# Altium schematic sheet LVDS.SchDoc
size A4; SheetNumber: 1; SheetTotal: 1
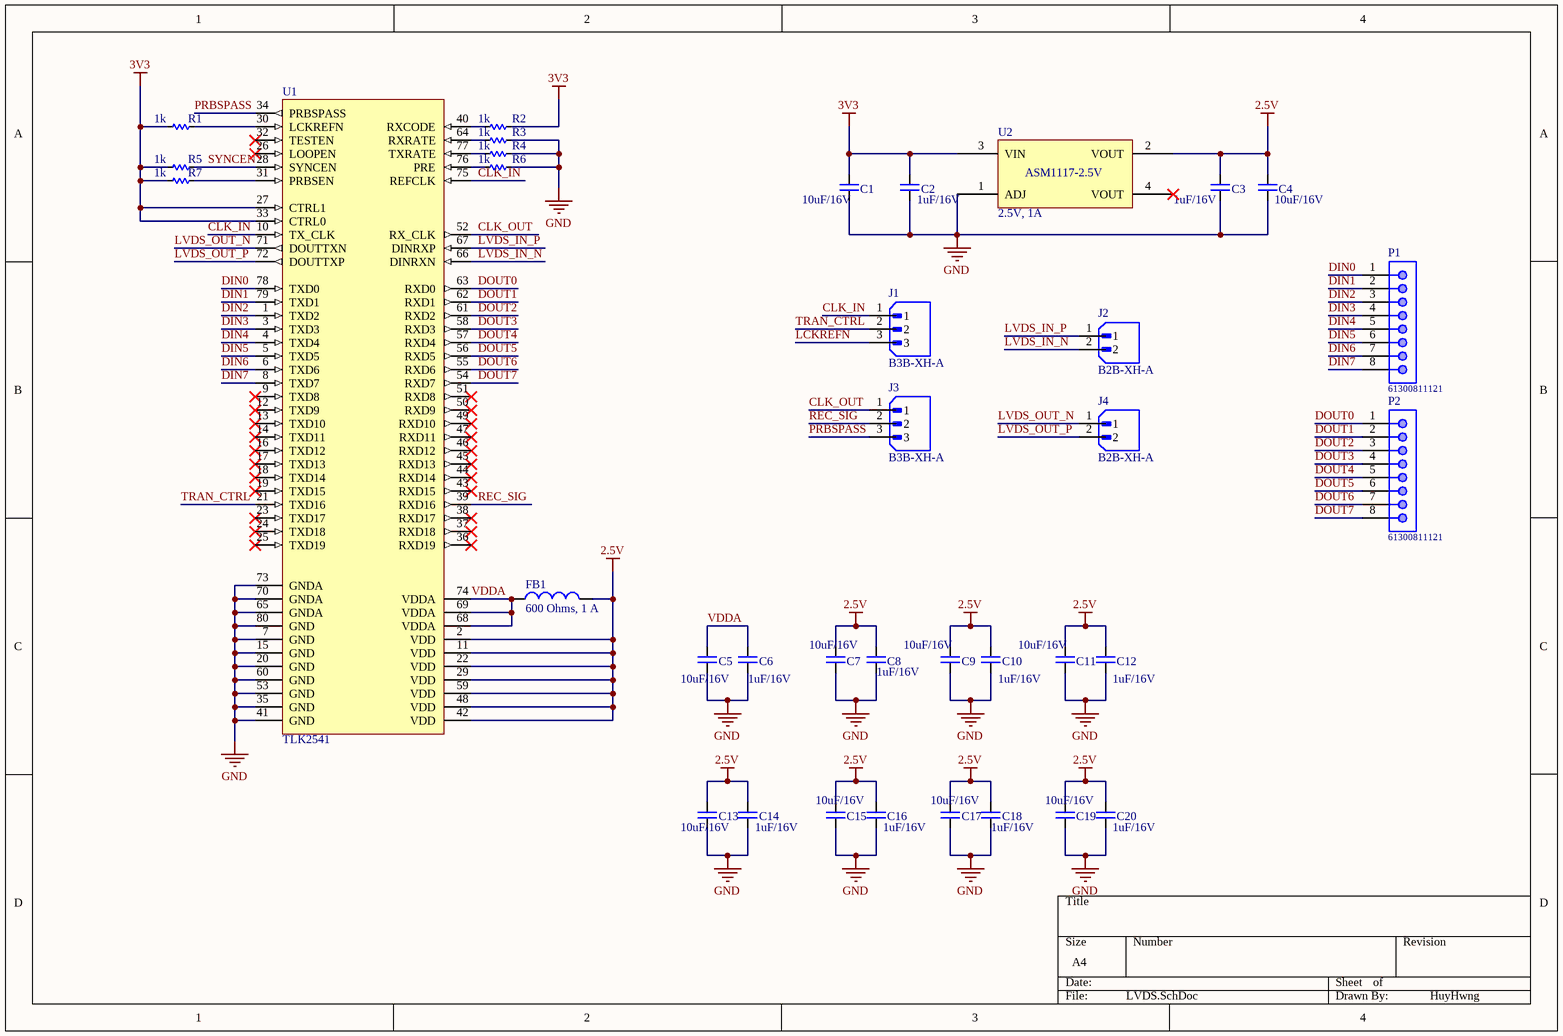
[diagram p0: LVDS.SchDoc]

## Parts
C1  10uF/16V  [CAP_C_1608X80]
C2  1uF/16V  [CAP_C_1608X80]
C3  1uF/16V  [CAP_C_1608X80]
C4  10uF/16V  [CAP_C_1608X80]
C5  10uF/16V  [CAP_C_1608X80]
C6  1uF/16V  [CAP_C_1608X80]
C7  10uF/16V  [CAP_C_1608X80]
C8  1uF/16V  [CAP_C_1608X80]
C9  10uF/16V  [CAP_C_1608X80]
C10  1uF/16V  [CAP_C_1608X80]
C11  10uF/16V  [CAP_C_1608X80]
C12  1uF/16V  [CAP_C_1608X80]
C13  10uF/16V  [CAP_C_1608X80]
C14  1uF/16V  [CAP_C_1608X80]
C15  10uF/16V  [CAP_C_1608X80]
C16  1uF/16V  [CAP_C_1608X80]
C17  10uF/16V  [CAP_C_1608X80]
C18  1uF/16V  [CAP_C_1608X80]
C19  10uF/16V  [CAP_C_1608X80]
C20  1uF/16V  [CAP_C_1608X80]
FB1  600 Ohms, 1 A  [FER_0603]
J1  B3B-XH-A  [JST_B3B-XH-A]
J2  B2B-XH-A  [JST_B2B-XH-A]
J3  B3B-XH-A  [JST_B3B-XH-A]
J4  B2B-XH-A  [JST_B2B-XH-A]
P1  61300811121  [61300811121]
P2  61300811121  [61300811121]
R1  1k  [RES_C_1608X60]
R2  1k  [RES_C_1608X60]
R3  1k  [RES_C_1608X60]
R4  1k  [RES_C_1608X60]
R5  1k  [RES_C_1608X60]
R6  1k  [RES_C_1608X60]
R7  1k  [RES_C_1608X60]
U1  TLK2541  [TLK2541]
U2  2.5V, 1A  [AMS1117-2.5V SOT223]

## Nets
2.5V: C3.2 C4.2 C7.2 C8.2 C9.2 C10.2 C11.2 C12.2 C13.2 C14.2 C15.2 C16.2 C17.2 C18.2 C19.2 C20.2 FB1.2 U1.2(VDD) U1.11(VDD) U1.22(VDD) U1.29(VDD) U1.42(VDD) U1.48(VDD) U1.59(VDD) U2.2(VOUT)
3V3: C1.2 C2.2 R1.2 R2.1 R5.2 R7.2 U1.27(CTRL1) U1.33(CTRL0) U2.3(VIN)
GND: C1.1 C2.1 C3.1 C4.1 C5.1 C6.1 C7.1 C8.1 C9.1 C10.1 C11.1 C12.1 C13.1 C14.1 C15.1 C16.1 C17.1 C18.1 C19.1 C20.1 R3.1 R4.1 R6.1 U1.7(GND) U1.15(GND) U1.20(GND) U1.35(GND) U1.41(GND) U1.53(GND) U1.60(GND) U1.65(GNDA) U1.70(GNDA) U1.73(GNDA) U1.80(GND) U2.1(ADJ)
CLK_IN: J1.1 U1.10(TX_CLK) U1.75(REFCLK)
CLK_OUT: J3.1 U1.52(RX_CLK)
DIN0: P1.1 U1.78(TXD0)
DIN1: P1.2 U1.79(TXD1)
DIN2: P1.3 U1.1(TXD2)
DIN3: P1.4 U1.3(TXD3)
DIN4: P1.5 U1.4(TXD4)
DIN5: P1.6 U1.5(TXD5)
DIN6: P1.7 U1.6(TXD6)
DIN7: P1.8 U1.8(TXD7)
DOUT0: P2.1 U1.63(RXD0)
DOUT1: P2.2 U1.62(RXD1)
DOUT2: P2.3 U1.61(RXD2)
DOUT3: P2.4 U1.58(RXD3)
DOUT4: P2.5 U1.57(RXD4)
DOUT5: P2.6 U1.56(RXD5)
DOUT6: P2.7 U1.55(RXD6)
DOUT7: P2.8 U1.54(RXD7)
LCKREFN: J1.3
LVDS_IN_N: J2.2 U1.66(DINRXN)
LVDS_IN_P: J2.1 U1.67(DINRXP)
LVDS_OUT_N: J4.1 U1.71(DOUTTXN)
LVDS_OUT_P: J4.2 U1.72(DOUTTXP)
PRBSPASS: J3.3 U1.34(PRBSPASS)
REC_SIG: J3.2 U1.39(RXD16)
SYNCEN: R5.1 U1.28(SYNCEN)
TRAN_CTRL: J1.2 U1.21(TXD16)
VDDA: C5.2 C6.2 FB1.1 U1.68(VDDA) U1.69(VDDA) U1.74(VDDA)
NetR1_1: R1.1 U1.30(LCKREFN)
NetR2_2: R2.2 U1.40(RXCODE)
NetR3_2: R3.2 U1.64(RXRATE)
NetR4_2: R4.2 U1.77(TXRATE)
NetR6_2: R6.2 U1.76(PRE)
NetR7_1: R7.1 U1.31(PRBSEN)

Not connected (* = marked no-connect by the designer): U1 9(TXD8)* 12(TXD9)* 13(TXD10)* 14(TXD11)* 16(TXD12)* 17(TXD13)* 18(TXD14)* 19(TXD15)* 23(TXD17)* 24(TXD18)* 25(TXD19)* 26(LOOPEN)* 32(TESTEN)* 36(RXD19)* 37(RXD18)* 38(RXD17)* 43(RXD15)* 44(RXD14)* 45(RXD13)* 46(RXD12)* 47(RXD11)* 49(RXD10)* 50(RXD9)* 51(RXD8)*; U2 4(VOUT)*

## Notes on the sheet
- HuyHwng
- (in symbol AMS1117-2.5V) ASM1117-2.5V

## Library data of the parts
C1-C20 = CAP_SMD: CAP_Chip; Value: 33pF
FB1 = 03060360110225: Ferrite, 0603, 600 Ohms, 1 A; Manufacture Name: Wurth Elektronik; Manufacture SN: 742792651; Tolerance: +/-25%; Maximum DC Current: 1 A; Maximum DC Resistance: 200 mOhms; Test Frequency: 100 MHz; ComponentLink2Description: Datasheet; ComponentLink2URL: https://www.we-online.com/catalog/datasheet/742792651.pdf; Mounting Technology: SMT; Operating Temperature: -55 to +125degC; Packaging: Tape and Reel; Size: 0603; Supplier 1 SN: 710-742792651; Supplier 1 URL: https://www.mouser.com/ProductDetail/Wurth-Elektronik/742792651?qs=sGAEpiMZZMt1hubY80%2Fs8M60rIzA20dgTaAssd1%2FEf4%3D&utm_source=mouser-refine-download&utm_medium=file&utm_campaign=742792651&utm_content=Wurth-Elektronik; Supplier 2 SN: N/A; Supplier 2 URL: N/A; Supplier 3 SN: N/A; Supplier 3 URL: N/A; Supplier 1 Name: Mouser; Supplier 2 Name: Digi-Key; Supplier 3 Name: thegioiic; Impedance: 600 Ohms; Value: 600 Ohms, 1 A
J1 J3 = B3B-XH-A: Connector Header Through Hole 3 position 0.098 (2.50mm); MF: JST Sales; SnapEDA_Link: https://www.snapeda.com/parts/B3B-XH-A/JST+Sales+America+Inc./view-part/?ref=snap; Package: None; Value: *; MP: B3B-XH-A; Check_prices: https://www.snapeda.com/parts/B3B-XH-A/JST+Sales+America+Inc./view-part/?ref=eda
J2 J4 = B2B-XH-A: MF: {'manufacturer': u'JST Sales America Inc.'}; Package: None; Price: None; Value: *; MP: B2B-XH-A; Availability: Unavailable
P1 P2 = 61300811121: WR-PHD Pin Header, THT, pitch 2.54mm, Single Row, Vertical, 8p; Manufacturer: Wurth Elektronik; Pin Number: 8; Rated Current: 3A; Working Voltage: 250VAC; Withstanding Voltage: 500VAC; Contact Resistance: 20mOhm; Supply Name 1: Mouser; ComponentLink1Description: Manufacturer; ComponentLink1URL: http://www.we-online.de; ComponentLink2Description: Datasheet; ComponentLink2URL: https://www.we-online.com/catalog/datasheet/61300811121.pdf; Manufacturer Part Number: 61300811121; Published Date: May 2020; Pitch: 2.54mm; Operating Temperature: -40 to +105degC; Mounting Technology: THT; Packaging: Bag; Gender: Pin Header; Row Number: Single; Orientation: Vertical; ComponentLink3Description: Global Supply; ComponentLink3URL: https://www.we-online.com/en/components/products/PHD_2_54_THT_PIN_HEADER_6130XX11121?sq=61300811121#61300811121; ComponentLink4Description: Global Supply; ComponentLink4URL: https://www.mouser.vn/ProductDetail/Wurth-Elektronik/61300811121?qs=PhR8RmCirEZRdx%252BVlEmRRA%3D%3D; Supplier 1 Name: Mouser; Supplier 1 SN: 710-61300811121; Supplier 1 URL: https://www.mouser.vn/ProductDetail/Wurth-Elektronik/61300811121?qs=PhR8RmCirEZRdx%252BVlEmRRA%3D%3D; Supplier 2 Name: Digi-Key; Supplier 2 SN: N/A; Supplier 2 URL: N/A; Supplier 3 Name: thegioiic; Supplier 3 SN: N/A; Supplier 3 URL: N/A
R1-R7 = _RES_B_2: RES
U1 = TLK2541: 1 TO2.6 GBPS TRANSCEIVER
U2 = AMS1117-2.5V: AMS1117-2.5V, OUT 2.5V 1A.; Manufacturer: AMS; Pad Count: 4; Voltage Input Maximum: 15V; Manufacturer Part Number: N/A; Current Input Maximum: N/A; Current Output Maximum: 1A; Supplier 1 Name: Mouser; Supplier 2 Name: Digi-Key; Supplier 3 Name: thegioiic; Voltage Output: 2.5V; Mounting Technology: SMD; ComponentLink1Description: Datasheet link; ComponentLink1URL: http://www.advanced-monolithic.com/pdf/ds1117.pdf; ComponentLink2Description: Supplier 1 URL; ComponentLink2URL: N/A; ComponentLink3Description: Supplier 2 URL; ComponentLink3URL: N/A; ComponentLink4Description: Supplier 3 URL; ComponentLink4URL: N/A; Supplier 1 SN: N/A; Supplier 1 URL: N/A; Supplier 2 SN: N/A; Supplier 2 URL: N/A; Supplier 3 SN: N/A; Supplier 3 URL: https://www.thegioiic.com/ams1117-2-5v-ic-on-ap-2-5v-1a-sot-223; Value: 2.5V, 1A